# EAGLE design SAMD21_Pro_RF (EAGLE 9.6.2)
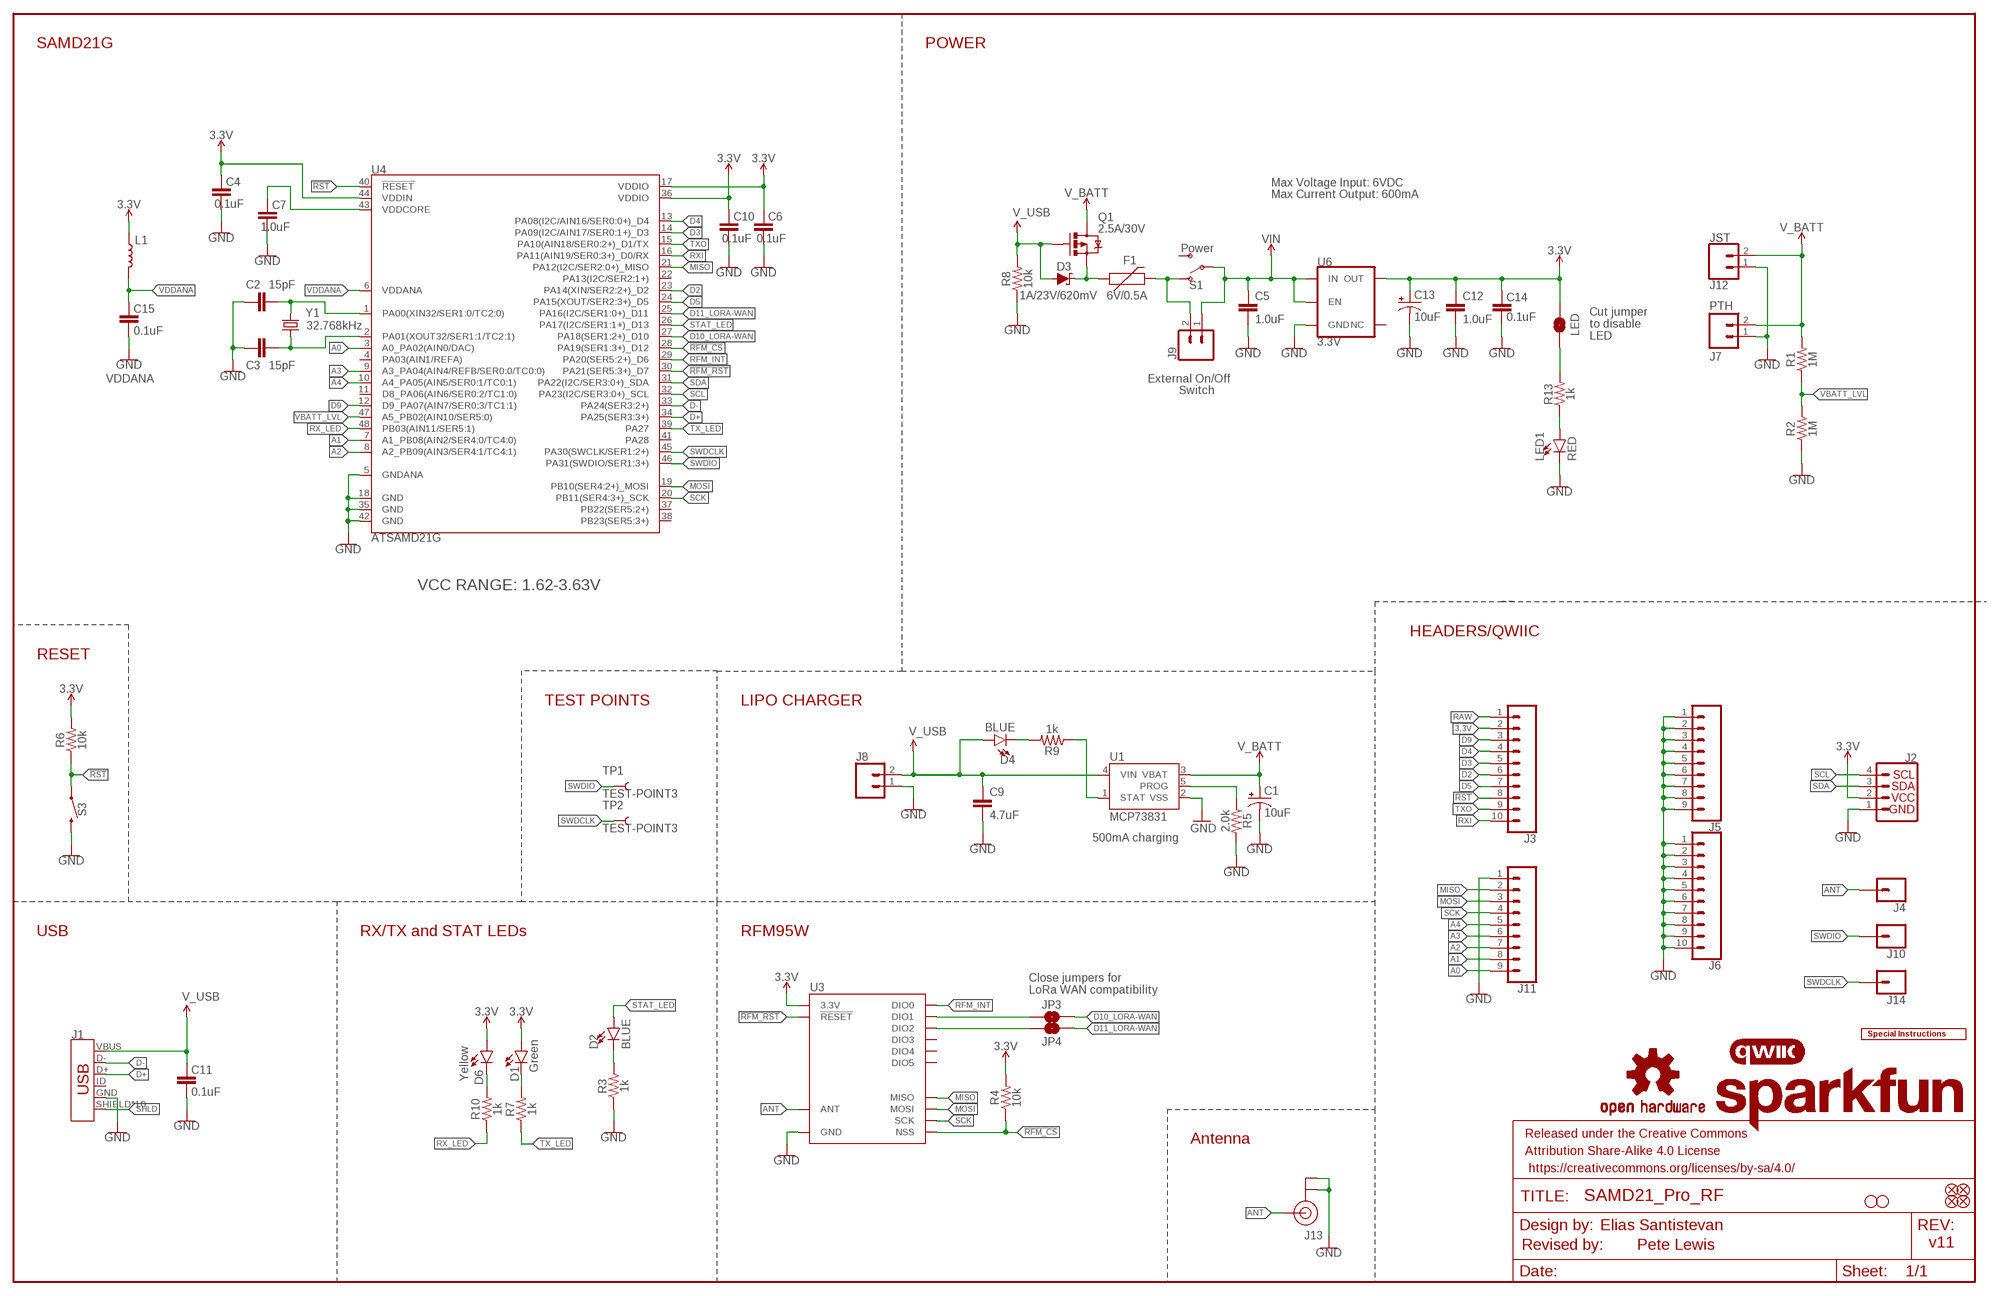
[diagram p0: schematic, sheet 1]

## Parts
C1  10uF  10UF-POLAR-EIA3216-16V-10%(TANT)  [EIA3216]
C2  15pF  15PF-0603-50V-5%  [0603]
C3  15pF  15PF-0603-50V-5%  [0603]
C4  0.1uF  0.1UF-0603-25V-(+80/-20%)  [0603]
C5  1.0uF  1.0UF-0603-16V-10%  [0603]
C6  0.1uF  0.1UF-0603-25V-(+80/-20%)  [0603]
C7  1.0uF  1.0UF-0603-16V-10%  [0603]
C9  4.7uF  4.7UF-0603-6.3V-(10%)  [0603]
C10  0.1uF  0.1UF-0603-25V-(+80/-20%)  [0603]
C11  0.1uF  0.1UF-0603-25V-(+80/-20%)  [0603]
C12  1.0uF  1.0UF-0603-16V-10%  [0603]
C13  10uF  10UF-POLAR-EIA3216-16V-10%(TANT)  [EIA3216]
C14  0.1uF  0.1UF-0603-25V-(+80/-20%)  [0603]
C15  0.1uF  0.1UF-0603-25V-(+80/-20%)  [0603]
D1  Green  LED-GREEN0603  [LED-0603]
D2  BLUE  LED-BLUE0603  [LED-0603]
D3  1A/23V/620mV  DIODE-SCHOTTKY-BAT20J  [SOD-323]
D4  BLUE  LED-BLUE0603  [LED-0603]
D6  Yellow  LED-YELLOW0603  [LED-0603]
F1  6V/0.5A  PPTC_HALF-AMP  [1206]
FD1  FIDUCIAL1X2  [FIDUCIAL-1X2]
FD2  FIDUCIAL1X2  [FIDUCIAL-1X2]
FD3  FIDUCIAL1X2  [FIDUCIAL-1X2]
FD4  FIDUCIAL1X2  [FIDUCIAL-1X2]
FRAME2  FRAME-LEDGER  [CREATIVE_COMMONS]
H1  STAND-OFFTIGHT  [STAND-OFF-TIGHT]
H2  STAND-OFFTIGHT  [STAND-OFF-TIGHT]
J1  USB_MICRO-B_HALF_PTH_MILL  [USB-MICROB-PTH-MILL]
J2  QWIIC_CONNECTORJS-1MM  [1X04_1MM_RA]
J3  CONN_10NO_SILK_PTH_FEMALE  [1X10_NO_SILK]
J4  CONN_01PTH_NO_SILK_YES_STOP  [1X01_NO_SILK]
J5  CONN_09NO_SILK  [1X09_NO_SILK]
J6  CONN_10NO_SILK_PTH_FEMALE  [1X10_NO_SILK]
J7  PTH  CONN_021X02_NO_SILK  [1X02_NO_SILK]
J8  CONN_021X02_NO_SILK  [1X02_NO_SILK]
J9  External On/Off  CONN_021X02_NO_SILK  [1X02_NO_SILK]
J10  CONN_01PTH_NO_SILK_YES_STOP  [1X01_NO_SILK]
J11  CONN_09NO_SILK  [1X09_NO_SILK]
J12  JST  CONN_02-JST-2MM-SMT  [JST-2-SMD]
J13  U.FL  [U.FL]
J14  CONN_01PTH_NO_SILK_YES_STOP  [1X01_NO_SILK]
JP3  JUMPER-SMT_2_NO_SILK  [SMT-JUMPER_2_NO_SILK]
JP4  JUMPER-SMT_2_NO_SILK  [SMT-JUMPER_2_NO_SILK]
L1  INDUCTORFB-30OHM  [0603]
LED  JUMPER-SMT_2_NC_TRACE_SILK  [SMT-JUMPER_2_NC_TRACE_SILK]
LED1  RED  LED-RED0603  [LED-0603]
LOGO1  OSHW-LOGOMINI  [OSHW-LOGO-MINI]
LOGO2  SFE_LOGO_NAME.1_INCH  [SFE_LOGO_NAME_.1]
LOGO3  QWIIC_LOGO_5MM  [QWIIC_5MM]
Q1  2.5A/30V  MOSFET-PCHANNELDMG2307L  [SOT23-3@1]
R1  1M  1MOHM-0603-1/4W-5%  [0603]
R2  1M  1MOHM-0603-1/4W-5%  [0603]
R3  1k  1KOHM-0603-1/10W-1%  [0603]
R4  10k  10KOHM-0603-1/10W-1%  [0603]
R5  2.0k  2.0KOHM-0603-1/10W-5%  [0603]
R6  10k  10KOHM-0603-1/10W-1%  [0603]
R7  1k  1KOHM-0603-1/10W-1%  [0603]
R8  10k  10KOHM-0603-1/10W-1%  [0603]
R9  1k  1KOHM-0603-1/10W-1%  [0603]
R10  1k  1KOHM-0603-1/10W-1%  [0603]
R13  1k  1KOHM-0603-1/10W-1%  [0603]
S1  Power  SWITCH-SPDT-SMD-RIGHT-ANGLE  [SWITCH_SPST_SMD_A]
S3  MOMENTARY-SWITCH-SPST-SMD-RIGHT-ANGLE  [TACTILE_SWITCH_SMD_RIGHT_ANGLE]
TP1  TEST-POINT3  [PAD.03X.03]
TP2  TEST-POINT3  [PAD.03X.03]
U1  MCP73831  [SOT23-5]
U3  RFM95W  [RFM95/96/97/98W]
U4  ATSAMD21G  [QFN-48_NO_EXPOSED_PAD]
U6  3.3V  V_REG_AP2112K-3.3V  [SOT23-5]
U$26  SPECIAL_INSTRUCTIONS-ORDERING  [ORDERING_INSTRUCTIONS]
Y1  32.768kHz  CRYSTAL-32.768KHZSMD-3.2X1.5  [CRYSTAL-SMD-3.2X1.5MM]

## Nets
3.3V [vcc]: C4.2 C6.2 C10.2 C12.1 C13.+ C14.2 D1.A D6.A J2.2 J3.2 L1.1 LED.1 R4.2 R6.2 U3.3.3V U4.17(VDDIO) U4.36(VDDIO) U4.44(VDDIN) U6.5(OUT)
!RFM_CS: R4.1 U3.NSS U4.28(PA19(SER1:3+)_D12)
!RFM_RST: U3.!RESET U4.30(PA21(SER5:3+)_D7)
!RST: J3.8 R6.1 S3.1 U4.40(!RESET!)
A0: J11.9 U4.3(A0_PA02(AIN0/DAC))
A1: J11.8 U4.7(A1_PB08(AIN2/SER4:0/TC4:0))
A2: J11.7 U4.8(A2_PB09(AIN3/SER4:1/TC4:1))
A3: J11.6 U4.9(A3_PA04(AIN4/REFB/SER0:0/TC0:0))
A4: J11.5 U4.10(A4_PA05(AIN5/SER0:1/TC0:1))
ANT: J4.1 J13.FEED(SIGNAL) U3.ANT
CHARGE_STAT: R9.1 U1.1(STAT)
D2: J3.6 U4.23(PA14(XIN/SER2:2+)_D2)
D3: J3.5 U4.14(PA09(I2C/AIN17/SER0:1+)_D3)
D4: J3.4 U4.13(PA08(I2C/AIN16/SER0:0+)_D4)
D5: J3.7 U4.24(PA15(XOUT/SER2:3+)_D5)
D9: J3.3 U4.12(D9_PA07(AIN7/SER0:3/TC1:1))
D10_LORA-WAN: JP3.2 U4.27(PA18(SER1:2+)_D10)
D11_LORA-WAN: JP4.2 U4.25(PA16(I2C/SER1:0+)_D11)
D+: J1.D+ U4.34(PA25(SER3:3+))
D-: J1.D- U4.33(PA24(SER3:2+))
GND: C1.- C2.1 C3.1 C4.1 C5.2 C6.1 C7.1 C9.2 C10.1 C11.1 C12.2 C13.- C14.1 C15.1 J1.GND J2.1 J5.1 J5.2 J5.3 J5.4 J5.5 J5.6 J5.7 J5.8 J5.9 J6.1 J6.2 J6.3 J6.4 J6.5 J6.6 J6.7 J6.8 J6.9 J6.10 J7.1 J8.1 J11.1 J12.1 J13.1(GND) J13.2(GND) LED1.C R2.1 R3.1 R5.2 R8.1 S3.2 U1.2(VSS) U3.GND@1(GND) U3.GND@2(GND) U3.GND@3(GND) U4.5(GNDANA) U4.18(GND) U4.35(GND) U4.42(GND) U6.2(GND)
MISO: J11.2 U3.MISO U4.21(PA12(I2C/SER2:0+)_MISO)
MOSI: J11.3 U3.MOSI U4.19(PB10(SER4:2+)_MOSI)
N$1: D6.C R10.2
N$2: D1.C R7.2
N$3: D2.C R3.2
N$4: C7.2 U4.43(VDDCORE)
N$5: LED.2 R13.2
N$6: C2.2 U4.1(PA00(XIN32/SER1:0/TC2:0)) Y1.P$2
N$7: C3.2 U4.2(PA01(XOUT32/SER1:1/TC2:1)) Y1.P$1
N$8: D4.C R9.2
N$9: F1.2 J9.2 S1.1(O)
N$11: R5.1 U1.5(PROG)
N$17: JP3.1 U3.DIO1
N$18: JP4.1 U3.DIO2
N$38: LED1.A R13.1
RAW [vcc]: D3.C F1.1 J3.1 Q1.2(S)
RFM_INT: U3.DIO0 U4.29(PA20(SER5:2+)_D6)
RX_LED: R10.1 U4.48(PB03(AIN11/SER5:1))
RXI: J3.10 U4.16(PA11(AIN19/SER0:3+)_D0/RX)
SCK: J11.4 U3.SCK U4.20(PB11(SER4:3+)_SCK)
SCL: J2.4 U4.32(PA23(I2C/SER3:0+)_SCL)
SDA: J2.3 U4.31(PA22(I2C/SER3:0+)_SDA)
SHLD: J1.SHIELD J1.SHIELD2(SHIELD) J1.SHIELD3(SHIELD) J1.SHIELD4(SHIELD) J1.SHIELD5(SHIELD) J1.SHIELD6(SHIELD) J1.SHIELD7(SHIELD) J1.SHIELD8(SHIELD) J1.SHIELD9(SHIELD) J1.SHIELD10(SHIELD)
STAT_LED: D2.A U4.26(PA17(I2C/SER1:1+)_D13)
SWDCLK: J14.1 TP2.P$1 U4.45(PA30(SWCLK/SER1:2+))
SWDIO: J10.1 TP1.P$1 U4.46(PA31(SWDIO/SER1:3+))
TX_LED: R7.1 U4.39(PA27)
TXO: J3.9 U4.15(PA10(AIN18/SER0:2+)_D1/TX)
V_BATT: C1.+ J7.2 J12.2 Q1.3(D) R1.2 U1.3(VBAT)
V_USB: C9.1 C11.2 D3.A D4.A J1.VBUS J8.2 Q1.1(G) R8.2 U1.4(VIN)
VBATT_LVL: R1.1 R2.2 U4.47(A5_PB02(AIN10/SER5:0))
VDDANA [vcc]: C15.2 L1.2 U4.6(VDDANA)
VIN: C5.1 J9.1 S1.2(P) U6.1(IN) U6.3(EN)
Unconnected: J1.ID S1.3(S) U3.DIO3 U3.DIO4 U3.DIO5 U4.4(PA03(AIN1/REFA)) U4.11(D8_PA06(AIN6/SER0:2/TC1:0)) U4.22(PA13(I2C/SER2:1+)) U4.37(PB22(SER5:2+)) U4.38(PB23(SER5:3+)) U4.41(PA28) U6.4(NC)

## Notes on the sheet
- SAMD21G | POWER
- Max Voltage Input: 6VDC
- Max Current Output: 600mA
- Cut jumper
  to disable
  LED
- VDDANA
- Switch
- VCC RANGE: 1.62-3.63V
- HEADERS/QWIIC
- RESET
- TEST POINTS | LIPO CHARGER
- 500mA charging
- USB | RX/TX and STAT LEDs | RFM95W
- Close jumpers for
  LoRa WAN compatibility
- Antenna
- Elias Santistevan
- Revised by: | Pete Lewis | v11

## Library data of the parts
C1 C13 = SparkFun-Capacitors:10UF-POLAR: 10.0µF polarized capacitors A capacitor is a passive two-terminal electrical component used to store electrical energy temporarily in an electric field.; PROD_ID: CAP-00811
C2 C3 = SparkFun-Capacitors:15PF: 15pF ceramic capacitors A capacitor is a passive two-terminal electrical component used to store electrical energy temporarily in an electric field.; PROD_ID: CAP-07881
C4 C6 C10 C11 C14 C15 = SparkFun-Capacitors:0.1UF: 0.1µF ceramic capacitors A capacitor is a passive two-terminal electrical component used to store electrical energy temporarily in an electric field.; PROD_ID: CAP-00810
C5 C7 C12 = SparkFun-Capacitors:1.0UF: 1µF ceramic capacitors A capacitor is a passive two-terminal electrical component used to store electrical energy temporarily in an electric field.; PROD_ID: CAP-00868
C9 = SparkFun-Capacitors:4.7UF: 4.7µF ceramic capacitors A capacitor is a passive two-terminal electrical component used to store electrical energy temporarily in an electric field.; PROD_ID: CAP-08280
D1 = SparkFun-LED:LED-GREEN: Green SMD LED Used in manufacturing of various products at SparkFun Packages: 0603 - SMD 0603 package [Product Link] <http://www.futureelectronics.com/en/technologies/semiconductors/optoelectronics/leds/Pages/9894312-LTST-C190GKT.aspx?CrossPart=HSMG-C190&IM=0> LilyPad 1206 - SMD1206 LilyPad package [Product Link] <http://www.futureelectronics.com/en/Technologies/Product.aspx?ProductID=IN150NGHARVATEKCORPORATION2049943&IM=0> 1206 - SMD1206 package [Product Link] <http://www.futureelectronics.com/en/technologies/semiconductors/optoelectronics/leds/Pages/8315665-LTST-C150KGKT.aspx?IM=0> 1206 Bottom Mount -SMD 1206 Bottom Mount [Product Link] <http://www.digikey.com/product-detail/en/lite-on-inc/LTST-C230KGKT/160-1456-1-ND/386854> SparkFun Products: Pro Mini 328 -5V <https://www.sparkfun.com/products/821> RedBoard <https://www.sparkfun.com/products/12757> MP3 Trigger <https://www.sparkfun.com/products/13720> Makey Makey <https://www.sparkfun.com/products/11076>; PROD_ID: DIO-00821; VALUE: GREEN
D2 D4 = SparkFun-LED:LED-BLUE: Blue SMD LED Used in manufacturing of various products at SparkFun Packages: 0603 - SMD 0603 package [Product Link] <http://www.digikey.com/product-detail/en/SMLE12BC7TT86/511-1589-2-ND/1641808> 1206 - SMD1206 package [Product Link] <http://www.digikey.com/product-detail/en/lite-on-inc/LTST-C150TBKT/160-1643-1-ND/573584> SparkFun Products: ESP8266 Thing-Dev Board <https://www.sparkfun.com/products/13711> RedBoard <https://www.sparkfun.com/products/12757>; PROD_ID: DIO-08575
D3 = SparkFun-DiscreteSemi:DIODE-SCHOTTKY: Schottky diode A Schottky diode is a semiconductor diode which has a low forward voltage drop and a very fast switching action.; PROD_ID: DIO-11623
D6 = SparkFun-LED:LED-YELLOW: Yellow SMD LED Used in manufacturing several products at SparkFun. Packages: 0603 - SMD 0603 package[Product Link] <http://www.kingbrightusa.com/product.asp?catalog_name=LED&product_id=APT1608SYCK> 0603 -SMART - SMART SMD 0603 package (more efficient/more expensive) [Product Link] <http://www.osram-os.com/osram_os/en/products/product-catalog/led-light-emitting-diodes/smartled-0603/ly-l29k/index.jsp> LilyPad - SMD1206 package[Product Datasheet] <https://www.sparkfun.com/datasheets/DevTools/LilyPad/Q150YUS4.pdf> SparkFun Products: Blynk Board <https://www.sparkfun.com/products/13794> IOIO-OTG <https://www.sparkfun.com/products/13613> XBee Explorer Serial <https://www.sparkfun.com/products/13225>; PROD_ID: DIO-09003
F1 = SparkFun-Fuses:PPTC: Resettable Fuse PPTC Resettable Fuse. Really a sort of resistor with a polymeric positive temperature coefficient whose resistance increases dramatically with an increase in temperature. When heated by the power passing through the resistance rises causing the current to be limited, protecting the circuit. This is achieved by the transition of the polymer from a crystalline to an amorphous state where the conductive carbon separates breaking the conductive pathways found in the cool crystalline structure. When a PPTC cools back down it resumes conducting letting the circuit turn back on. SparkFun Products: SparkFun RedBoard - Programmed with Arduino <https://www.sparkfun.com/products/12757> Pro Micro - 5V/16MHz <https://www.sparkfun.com/products/12640> Arduino Pro 328 - 5V/16MHz <https://www.sparkfun.com/products/10915> MP3 Trigger <https://www.sparkfun.com/products/13720>; PROD_ID: RES-08585
FD1-FD4 = SparkFun-Aesthetics:FIDUCIAL: Fiducial Alignment Points Point-of-reference for pick-and-place machines and other optical instruments.
FRAME2 = SparkFun-Aesthetics:FRAME-LEDGER: Schematic Frame - Ledger Standard 11x14 US Ledger frame
H1 H2 = SparkFun-Hardware:STAND-OFF: Stand Off Drill holes for mechanically mounting via screws, standoffs, etc. Note: Use the keepout ring to avoid running the screw head into surrounding components. Variant Overviews STAND-OFF - Mechanical footprint for a #4 phillips button head screw. STAND-OFF-TIGHT - Mechanical footprint for a #4 phillips button head screw, Example SparkFun Products Screw - Phillips Head (1/4", 4-40, 10 pack) <https://www.sparkfun.com/products/10453> (PRT-10453) Screw - Phillips Head (1/2", 4-40, 10 pack) <https://www.sparkfun.com/products/10452> (PRT-10452) Screw - Phillips Head (3/4", 4-40, 10 pack) <https://www.sparkfun.com/products/10451> (PRT-10451) Screw - Phillips Head (1", 4-40, 10 pack) <https://www.sparkfun.com/products/10450> (PRT-10450)
J1 = SparkFun-Connectors:USB_MICRO-B: USB Type Micro-B Connector Male/female and PTH/SMT variants SparkFun Products: SparkFun microB USB Breakout <https://www.sparkfun.com/products/12035> SparkFun USB microB Plug Breakout <https://www.sparkfun.com/products/10031> SparkFun ESP8266 Thing <https://www.sparkfun.com/products/13231>; PROD_ID: CONN-13711
J2 = SparkFun-Connectors:QWIIC_CONNECTOR: SparkFun I2C Standard Qwiic Connector An SMD 1mm pitch JST connector makes it easy and quick (get it? Qwiic?) to connect I2C devices to each other. The Qwiic system <http://www.sparkfun.com/qwiic> enables fast and solderless connection between popular platforms and various sensors and actuators. We carry 200mm <https://www.sparkfun.com/products/14204>, 100mm <https://www.sparkfun.com/products/14205>, 50mm <https://www.sparkfun.com/products/14206>, and breadboard friendly <https://www.sparkfun.com/products/14207> Qwiic cables. We also offer 10 pcs strips <https://www.sparkfun.com/products/14323> the SMD connectors.; PROD_ID: CONN-13694
J3 J6 = SparkFun-Connectors:CONN_10: Multi connection point. Often used as Generic Header-pin footprint for 0.1 inch spaced/style header connections On any of the 0.1 inch spaced packages, you can populate with these: Break Away Headers - Straight <https://www.sparkfun.com/products/116> (PRT-00116) Break Away Male Headers - Right Angle <https://www.sparkfun.com/products/553> (PRT-00553) Female Headers <https://www.sparkfun.com/products/115> (PRT-00115) Break Away Headers - Machine Pin <https://www.sparkfun.com/products/117> (PRT-00117) Break Away Female Headers - Swiss Machine Pin <https://www.sparkfun.com/products/743> (PRT-00743) Arduino Stackable Header - 10 Pin <https://www.sparkfun.com/products/11376> (PRT-11376) For SCREWTERMINALS and SPRING TERMINALS visit here: Screw Terimnals on SparkFun.com <https://www.sparkfun.com/search/results?term=Screw+Terminals> (5mm/3.5mm/2.54mm spacing) This device is also useful as a general connection point to wire up your design to another part of your project. Our various solder wires solder well into these plated through hole pads. Hook-Up Wire - Assortment (Stranded, 22 AWG) <https://www.sparkfun.com/products/11375> (PRT-11375) Hook-Up Wire - Assortment (Solid Core, 22 AWG) <https://www.sparkfun.com/products/11367> (PRT-11367) View the entire wire category on our website here <https://www.sparkfun.com/categories/141> Special notes: Molex polarized connector foot print use with SKU : PRT-08231 with associated crimp pins and housings. 1MM SMD Version SKU: PRT-10208 NOTES ON THE VARIANTS LOCK and LOCK_LONGPADS... This footprint was designed to help hold the alignment of a through-hole component (i.e. 6-pin header) while soldering it into place. You may notice that each hole has been shifted either up or down by 0.005 of an inch from it's more standard position (which is a perfectly straight line). This slight alteration caused the pins (the squares in the middle) to touch the edges of the holes. Because they are alternating, it causes a "brace" to hold the component in place. 0.005 has proven to be the perfect amount of "off-center" position when using our standard breakaway headers. Although looks a little odd when you look at the bare footprint, once you have a header in there, the alteration is very hard to notice. Also,if you push a header all the way into place, it is covered up entirely on the bottom side.; PROD_ID: CONN-11563
J4 J10 J14 = SparkFun-Connectors:CONN_01: Single connection point. Often used as Generic Header-pin footprint for 0.1 inch spaced/style header connections On any of the 0.1 inch spaced packages, you can populate with these: Break Away Headers - Straight <https://www.sparkfun.com/products/116> (PRT-00116) Break Away Male Headers - Right Angle <https://www.sparkfun.com/products/553> (PRT-00553) Female Headers <https://www.sparkfun.com/products/115> (PRT-00115) Break Away Headers - Machine Pin <https://www.sparkfun.com/products/117> (PRT-00117) Break Away Female Headers - Swiss Machine Pin <https://www.sparkfun.com/products/743> (PRT-00743) This device is also useful as a general connection point to wire up your design to another part of your project. Our various solder wires solder well into these plated through hole pads. Hook-Up Wire - Assortment (Stranded, 22 AWG) <https://www.sparkfun.com/products/11375> (PRT-11375) Hook-Up Wire - Assortment (Solid Core, 22 AWG) <https://www.sparkfun.com/products/11367> (PRT-11367) View the entire wire category on our website here <https://www.sparkfun.com/categories/141> Special notes: SMTSO-256-ET is a "flush mount" nut for a 4-40 screw. We mostly use this on specialty testbeds; it is a nice way to connect hardware to your PCB at an adjustable hieght. Also note, the SNAP packages are for using a snappable style connector. We sell a baggie of snaps and they are also used on two LilyPad designs: Snap Assortment - 30 pack (male and female) <https://www.sparkfun.com/products/11347> (DEV-11347) LilyPad Arduino SimpleSnap <https://www.sparkfun.com/products/10941> (DEV-10941) LilyPad SimpleSnap Protoboard <https://www.sparkfun.com/products/10940> (DEV-10940)
J5 J11 = SparkFun-Connectors:CONN_09: Multi connection point. Often used as Generic Header-pin footprint for 0.1 inch spaced/style header connections On any of the 0.1 inch spaced packages, you can populate with these: Break Away Headers - Straight <https://www.sparkfun.com/products/116> (PRT-00116) Break Away Male Headers - Right Angle <https://www.sparkfun.com/products/553> (PRT-00553) Female Headers <https://www.sparkfun.com/products/115> (PRT-00115) Break Away Headers - Machine Pin <https://www.sparkfun.com/products/117> (PRT-00117) Break Away Female Headers - Swiss Machine Pin <https://www.sparkfun.com/products/743> (PRT-00743) For SCREWTERMINALS and SPRING TERMINALS visit here: Screw Terimnals on SparkFun.com <https://www.sparkfun.com/search/results?term=Screw+Terminals> (5mm/3.5mm/2.54mm spacing) This device is also useful as a general connection point to wire up your design to another part of your project. Our various solder wires solder well into these plated through hole pads. Hook-Up Wire - Assortment (Stranded, 22 AWG) <https://www.sparkfun.com/products/11375> (PRT-11375) Hook-Up Wire - Assortment (Solid Core, 22 AWG) <https://www.sparkfun.com/products/11367> (PRT-11367) View the entire wire category on our website here <https://www.sparkfun.com/categories/141> Special notes: Molex polarized connector foot print use with SKU : PRT-08231 with associated crimp pins and housings. 1MM SMD Version SKU: PRT-10208 NOTES ON THE VARIANTS LOCK and LOCK_LONGPADS... This footprint was designed to help hold the alignment of a through-hole component (i.e. 6-pin header) while soldering it into place. You may notice that each hole has been shifted either up or down by 0.005 of an inch from it's more standard position (which is a perfectly straight line). This slight alteration caused the pins (the squares in the middle) to touch the edges of the holes. Because they are alternating, it causes a "brace" to hold the component in place. 0.005 has proven to be the perfect amount of "off-center" position when using our standard breakaway headers. Although looks a little odd when you look at the bare footprint, once you have a header in there, the alteration is very hard to notice. Also,if you push a header all the way into place, it is covered up entirely on the bottom side.
J7-J9 = SparkFun-Connectors:CONN_02: Multi connection point. Often used as Generic Header-pin footprint for 0.1 inch spaced/style header connections On any of the 0.1 inch spaced packages, you can populate with these: Break Away Headers - Straight <https://www.sparkfun.com/products/116> (PRT-00116) Break Away Male Headers - Right Angle <https://www.sparkfun.com/products/553> (PRT-00553) Female Headers <https://www.sparkfun.com/products/115> (PRT-00115) Break Away Headers - Machine Pin <https://www.sparkfun.com/products/117> (PRT-00117) Break Away Female Headers - Swiss Machine Pin <https://www.sparkfun.com/products/743> (PRT-00743) For SCREWTERMINALS and SPRING TERMINALS visit here: Screw Terimnals on SparkFun.com <https://www.sparkfun.com/search/results?term=Screw+Terminals> (5mm/3.5mm/2.54mm spacing) This device is also useful as a general connection point to wire up your design to another part of your project. Our various solder wires solder well into these plated through hole pads. Hook-Up Wire - Assortment (Stranded, 22 AWG) <https://www.sparkfun.com/products/11375> (PRT-11375) Hook-Up Wire - Assortment (Solid Core, 22 AWG) <https://www.sparkfun.com/products/11367> (PRT-11367) View the entire wire category on our website here <https://www.sparkfun.com/categories/141> Special notes: Molex polarized connector foot print use with: PRT-08233 with associated crimp pins and housings. 2.54_SCREWTERM for use with PRT-10571. 3.5mm Screw Terminal footprints for PRT-08084 5mm Screw Terminal footprints for use with PRT-08432
J12 = SparkFun-Connectors:CONN_02: Multi connection point. Often used as Generic Header-pin footprint for 0.1 inch spaced/style header connections On any of the 0.1 inch spaced packages, you can populate with these: Break Away Headers - Straight <https://www.sparkfun.com/products/116> (PRT-00116) Break Away Male Headers - Right Angle <https://www.sparkfun.com/products/553> (PRT-00553) Female Headers <https://www.sparkfun.com/products/115> (PRT-00115) Break Away Headers - Machine Pin <https://www.sparkfun.com/products/117> (PRT-00117) Break Away Female Headers - Swiss Machine Pin <https://www.sparkfun.com/products/743> (PRT-00743) For SCREWTERMINALS and SPRING TERMINALS visit here: Screw Terimnals on SparkFun.com <https://www.sparkfun.com/search/results?term=Screw+Terminals> (5mm/3.5mm/2.54mm spacing) This device is also useful as a general connection point to wire up your design to another part of your project. Our various solder wires solder well into these plated through hole pads. Hook-Up Wire - Assortment (Stranded, 22 AWG) <https://www.sparkfun.com/products/11375> (PRT-11375) Hook-Up Wire - Assortment (Solid Core, 22 AWG) <https://www.sparkfun.com/products/11367> (PRT-11367) View the entire wire category on our website here <https://www.sparkfun.com/categories/141> Special notes: Molex polarized connector foot print use with: PRT-08233 with associated crimp pins and housings. 2.54_SCREWTERM for use with PRT-10571. 3.5mm Screw Terminal footprints for PRT-08084 5mm Screw Terminal footprints for use with PRT-08432; PROD_ID: CONN-11443
J13 = SparkFun-Connectors:U.FL: SMD Antenna Connector - U.FL 2mm height, 3.0mm x 3.0mm receptacle size. SparkFun Products: SparkFun WiFi Shield - ESP8266 <https://www.sparkfun.com/products/13287> SparkFun ESP8266 Thing <https://www.sparkfun.com/products/13231> SparkFun MiniGen - Pro Mini Signal Generator Shield <https://www.sparkfun.com/products/11420>; PROD_ID: CONN-09193; SF_ID: WRL-09144
JP3 JP4 = SparkFun-Jumpers:JUMPER-SMT_2_NO: Normally open jumper This jumper has two pads in close proximity to each other. Apply solder to close the connection. Round pads are easier to solder for beginners, but are a lot larger. SparkFun Product that uses the round pads: SparkFun EL Sequencer <https://www.sparkfun.com/products/12781>
L1 = SparkFun-Coils:INDUCTOR: Inductors Resist changes in electrical current. Basically a coil of wire. SparkFun Products: SparkFun Load Cell Amplifier - HX711 <https://www.sparkfun.com/products/13879> IOIO-OTG - V2.2 <https://www.sparkfun.com/products/13613>; PROD_ID: NDUC-07859
LED = SparkFun-Jumpers:JUMPER-SMT_2_NC_TRACE: Normally closed trace jumper This jumper has a trace between two pads so it's normally closed (NC). Use a razor knife to open the connection. For best results follow the IPC guidelines for cutting traces: Cutout at least 0.063 mm (0.005 in). Remove all loose material to clean up the cut area. Seal the cut with an approved epoxy. Reapply solder to reclose the connection.
LED1 = SparkFun-LED:LED-RED: Red SMD LED Used in manufacturing of most products at SparkFun Packages: 0603 - SMD 0603 package [Product Link] <http://docs.avagotech.com/docs/AV02-0551EN> 0603 SMART - SMD 0603 SMART package ( more efficient and expensive)[Product Link] <http://www.osram-os.com/Graphics/XPic2/00077099_0.pdf> 1206 - SMD1206 package [Product Link] <https://www.sparkfun.com/datasheets/DevTools/LilyPad/Q150OVS4.pdff> SparkFun Products: Pro Mini 328 -5V <https://www.sparkfun.com/products/821> RedBoard <https://www.sparkfun.com/products/12757> IOIO-OTG <https://www.sparkfun.com/products/13613>; PROD_ID: DIO-00819
LOGO1 = SparkFun-Aesthetics:OSHW-LOGO: Open-Source Hardware (OSHW) Logo This logo indicates the piece of hardware it is found on incorporates a OSHW license and/or adheres to the definition of open source hardware found here: http://freedomdefined.org/OSHW
LOGO2 = SparkFun-Aesthetics:SFE_LOGO_NAME: SparkFun Font Logo This is the SparkFun name logo. The logo on the schematic will always be the same size; the package variant is the height of the flame part of the logo (or the height the flame would be, if it were drawn). Default layer for the logo on the board is tSilk.
LOGO3 = SparkFun-Aesthetics:QWIIC_LOGO: Qwiic Logos for placement on schematic and PCB. The 5.5mm silk logo is best for placing next to Qwiic connector.
Q1 = SparkFun-DiscreteSemi:MOSFET-PCHANNEL: Generic PMOSFET IRLML2244 - TRANS-11153 (SOT-23 -20V -4.3A) (1.Gate 2.Source 3.Drain) FQP27P06 - COM-10349 <http://www.sparkfun.com/products/10349> (TO-220 -60V -27A) (1.Gate 2.Source 3.Drain); PROD_ID: TRANS-11308
R1 R2 = SparkFun-Resistors:1MOHM: 1MΩ resistor A resistor is a passive two-terminal electrical component that implements electrical resistance as a circuit element. Resistors act to reduce current flow, and, at the same time, act to lower voltage levels within circuits. - Wikipedia; PROD_ID: RES-07868
R3 R7 R9 R10 R13 = SparkFun-Resistors:1KOHM: 1kΩ resistor A resistor is a passive two-terminal electrical component that implements electrical resistance as a circuit element. Resistors act to reduce current flow, and, at the same time, act to lower voltage levels within circuits. - Wikipedia; PROD_ID: RES-07856
R4 R6 R8 = SparkFun-Resistors:10KOHM: 10kΩ resistor A resistor is a passive two-terminal electrical component that implements electrical resistance as a circuit element. Resistors act to reduce current flow, and, at the same time, act to lower voltage levels within circuits. - Wikipedia; PROD_ID: RES-00824
R5 = SparkFun-Resistors:2.0KOHM: 2kΩ resistor A resistor is a passive two-terminal electrical component that implements electrical resistance as a circuit element. Resistors act to reduce current flow, and, at the same time, act to lower voltage levels within circuits. - Wikipedia; PROD_ID: RES-08296
S1 = SparkFun-Switches:SWITCH-SPDT: Single Pole, Double Throw (SPDT) Switch Single-pole, double-throw (SPDT) switch. Variant Overview SMD-AYZ0202 Surface Mount DPDT Switch <https://www.sparkfun.com/products/597> (COM-00597) Used on e.g. LilyPad Arduino USB - ATmega32U4 Board <https://www.sparkfun.com/products/12049> PTH-11.6X4.0MM SPDT Mini Power Switch <https://www.sparkfun.com/products/102> (COM-00102) Used on e.g. SparkFun Simon Says - Through-Hole Soldering Kit <https://www.sparkfun.com/products/10547> (KIT-10547) PTH-11.6X4.0MM-KIT KIT version of SPDT Mini Power Switch - Simplifies soldering by removing tStop of switch pins - only one side can be soldered. PTH-11.6X4.0MM-LOCK LOCK version of SPDT Mini Power Switch - Offset pins hold switch in place for easier soldering. SMD-RIGHT-ANGLE Surface Mount Right Angle Switch <https://www.sparkfun.com/products/10860> (COM-10860) Used on e.g. SparkFun ESP8266 Thing <https://www.sparkfun.com/products/13231>; PROD_ID: SWCH-10651; SF_SKU: COM-10860
S3 = SparkFun-Switches:MOMENTARY-SWITCH-SPST: Momentary Switch (Pushbutton) - SPST Normally-open (NO) SPST momentary switches (buttons, pushbuttons). Variants PTH-12MM - 12mm square, through-hole Momentary Pushbutton Switch - 12mm Square <https://www.sparkfun.com/products/9190> (COM-09190) PTH-6.0MM, PTH-6.0MM-KIT - 6.0mm square, through-hole Mini Pushbutton Switch <https://www.sparkfun.com/products/97> (COM-00097) KIT package intended for soldering kit's - only one side of pads' copper is exposed. PTH-RIGHT-ANGLE-KIT - Right-angle, through-hole Right Angle Tactile Button <https://www.sparkfun.com/products/10791> - Used on SparkFun BigTime Watch Kit <https://www.sparkfun.com/products/11734> SMD-12MM - 12mm square, surface-mount Tactile Button - SMD (12mm) <https://www.sparkfun.com/products/12993> (COM-12993) Used on SparkFun PicoBoard <https://www.sparkfun.com/products/11888> SMD-4.5MM - 4.5mm Square Trackball Switch Used on SparkFun Blackberry Trackballer Breakout <https://www.sparkfun.com/products/13169> SMD-4.6MMX2.8MM - 4.60mm x 2.80mm, surface mount Used on SparkFun SAMD21 Mini Breakout <https://www.sparkfun.com/products/13664> SMD-5.2MM, SMD-5.2-REDUNDANT - 5.2mm square, surface-mount Mini Pushbutton Switch - SMD <https://www.sparkfun.com/products/8720> (COM-08720) Used on Arduino Pro Mini <https://www.sparkfun.com/products/11114> REDUNDANT package connects both switch circuits together SMD-6.0X3.5MM - 6.0 x 3.5mm, surface mount Momentary Reset Switch SMD <https://www.sparkfun.com/products/8229> (COM-08229) SMD-6.2MM-TALL - 6.2mm square, surface mount Tactile Button - SMD (6mm) <https://www.sparkfun.com/products/12992> Used on SparkFun Digital Sandbox <https://www.sparkfun.com/products/12651> SMD-RIGHT-ANGLE - Right-angle, surface mount Used on SparkFun Block for Intel® Edison - Arduino <https://www.sparkfun.com/products/13036>; PROD_ID: COMP-12265
TP1 TP2 = SparkFun-Connectors:TEST-POINT: SparkFun Test Points Bare copper test points for troubleshooting or In-Circuit-Testing. These are used by our Production team for verifying production board runs using pogo-pins on test beds. SparkFun Products: SparkFun LSM9DS1 Breakout <https://www.sparkfun.com/products/13284> SparkFun PSOC <https://www.sparkfun.com/products/13714> SparkFun Load Cell Amplifier <https://www.sparkfun.com/products/13879>
U1 = SparkFun-IC-Power:MCP73831: MCP73831T Li-Ion, Li-Pol Controller Miniature single cell, fully integrated Li-Ion, Li-polymer charge management controller Datasheet <http://ww1.microchip.com/downloads/en/DeviceDoc/20001984g.pdf> SparkFun Products: SparkFun ESP32 Thing <https://www.sparkfun.com/products/13907> SparkFun 9DoF Razor IMU M0 <https://www.sparkfun.com/products/14001>; PROD_ID: IC-09995
U3 = SparkFun-RF:RFM95W: RFM95/96/97/98 The RFM95/96/97/98(W) transceivers feature the LoRaTM long range modem that provides ultra-long range spread spectrum communication and high interference immunity whilst minimising current consumption. These devices also support high performance (G)FSK modes for systems including WMBus, IEEE802.15.4g. The RFM95/96/97/98(W) deliver exceptional phase noise, selectivity, receiver linearity and IIP3 for significantly lower current consumption than competing devices Datasheet <http://www.hoperf.com/upload/rf/RFM95_96_97_98W.pdf>; PROD_ID: IC-13959
U4 = SparkFun-IC-Microcontroller:ATSAMD21G: Atmel SAMD21G SMART ARM-Based Microcontroller The Atmel ® | SMART ™ SAM D21 is a series of low-power microcontrollers using the 32-bit ARM ® Cortex ® -M0+ processor, and ranging from 32- to 64-pins with up to 256KB Flash and 32KB of SRAM. The SAM D21 devices operate at a maximum frequency of 48MHz and reach 2.46 CoreMark/MHz. They are designed for simple and intuitive migration with identical peripheral modules, hex compatible code, identical linear address map and pin compatible migration paths between all devices in the product series. All devices include intelligent and flexible peripherals, Atmel Event System for inter-peripheral signaling, and support for capacitive touch button, slider and wheel user interfaces. Datasheet <https://cdn.sparkfun.com/datasheets/Dev/Arduino/Boards/Atmel-42181-SAM-D21_Datasheet.pdf> SparkFun Products SparkFun SAMD21 Mini Breakout <https://www.sparkfun.com/products/13664> (DEV-13664) SparkFun SAMD21 Dev Breakout <https://www.sparkfun.com/products/13672> (DEV-13672) (DEV-14926); PROD_ID: IC-14066
U6 = SparkFun-IC-Power:V_REG_AP2112: AP2112 - 600mA CMOS LDO Regulator w/ Enable The AP2112 is CMOS process low dropout linear regulator with enable function, the regulator delivers a guaranteed 600mA (min.) continuous load current. Features Output Voltage Accuracy: ±1.5% Output Current: 600mA (Min.) Foldback Short Current Protection: 50mA Enable Function to Turn ON/OFF VOUT Low Dropout Voltage (3.3V): 250mV (Typ.) @IOUT=600mA Excellent Load Regulation: 0.2%/A (Typ.) Excellent Line Regulation: 0.02%/V (Typ.) Low Quiescent Current: 55μA (Typ.) Low Standby Current: 0.01μA (Typ.) Low Output Noise: 50μVRMS PSRR: 100Hz -65dB, 1kHz -65dB OTSD Protection Stable with 1.0μF Flexible Cap: Ceramic, Tantalum and Aluminum Electrolytic Operation Temperature Range: -40°C to 85°C ESD: MM 400V, HBM 4000V; PROD_ID: VREG-12457
U$26 = SparkFun-Aesthetics:SPECIAL_INSTRUCTIONS: Special Ordering/Production Instructions Alert Symbol for special PCB ordering instructions or unique production process warnings. Ordering Instructions Production Instructions Types of information that should be added to box: Copper weight Soldermask color Silk color PCB thickness Number of layers PCB Standard: 1.6mm FR4 1 oz copper immersion silver plating red soldermask white silkscreen Types of information that should be added to box: Special wash requirements Depaneling instructions Humidification Glue curing Default text settings: 0.07 inch 9% ratio 50% line distance
Y1 = SparkFun-Clocks:CRYSTAL-32.768KHZ: 32.768kHz Crystal Frequency: 32.768kHz Frequency Stability: ±20ppm Load Capacitance: 12.5pF (PTH-2X6 & SMD-3.2X1.5), 6pF (SMD-2X6) SparkFun Products: SparkFun BigTime Watch Kit <https://www.sparkfun.com/products/11734> SparkFun nRF52832 Breakout <https://www.sparkfun.com/products/13990> SparkFun Real Time Clock Module <https://www.sparkfun.com/products/12708>; PROD_ID: XTAL-13062

## Net classes
0 default: width 0 mm, drill 0 mm
1 vcc: width 0 mm

## Board
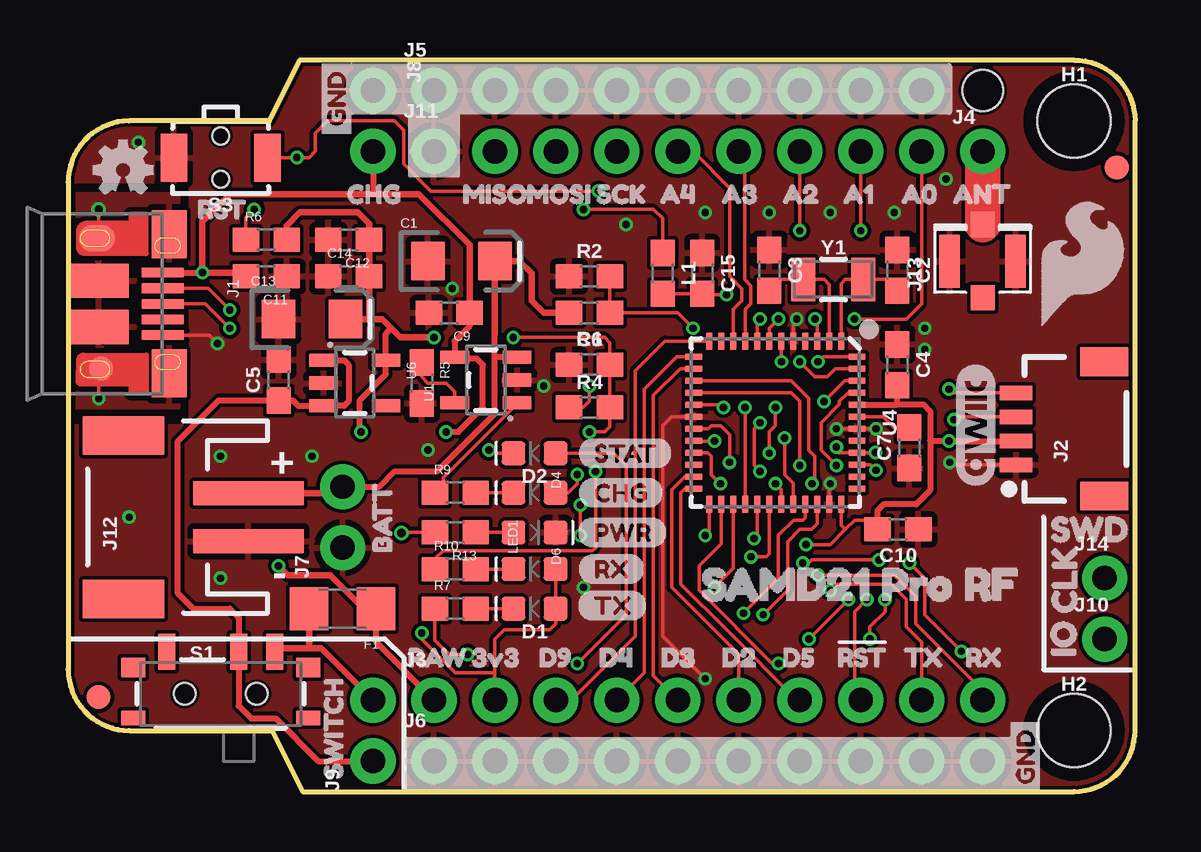
[diagram p1: board, top side]
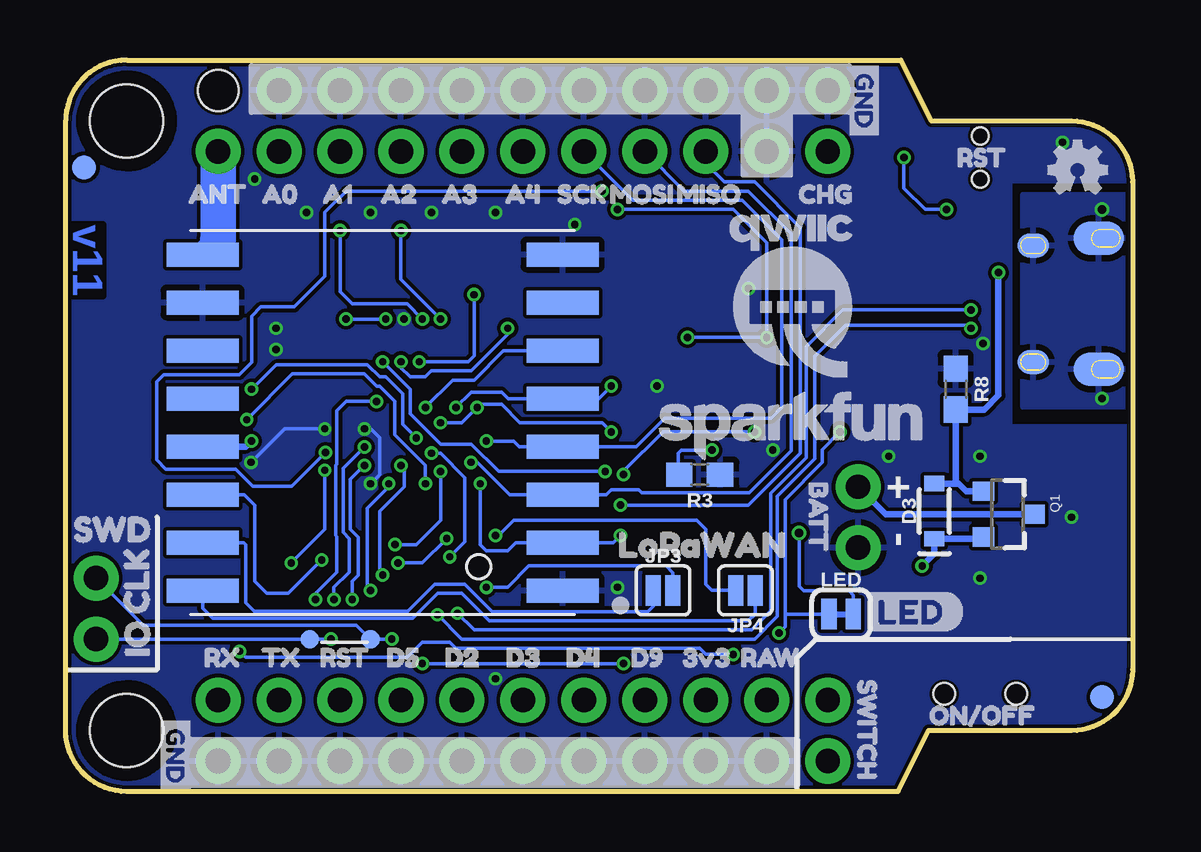
[diagram p2: board, bottom side, seen from below]

Size 44.45 x 30.48 mm. Coordinates in mm from the lower left corner, seen from the top.
Outline: 8.51,2.54 9.78,0 41.91,0 arc90 44.45,2.54 44.45,27.94 arc90 41.91,30.48 9.65,30.48 8.38,27.94 2.54,27.94 arc90 0,25.4 0,5.08 arc90 2.54,2.54 8.51,2.54
Copper layers (1*16): Top 0.035mm / dielectric 1.5mm / Bottom 0.035mm
Design rules "SparkFun-2-layer-FAB-LIMIT": minimum track width 4mil, minimum drill 6mil, track to track 4mil, track to pad 4mil, pad to pad 4mil, via to via 4mil, smd to smd 4mil, copper to edge 4mil, drill to drill 4mil, minimum pad ring 5mil, minimum via ring 5mil, stop-mask expansion 4mil, vias tented up to drill 25mil, thermal gap 10mil
Holes 1.7 mm at 38.1,29.21

### Footprints (pad centres in the part's own frame; a part is rotated, then mirrored left to right if it is on the bottom)
EIA3216 = smd 1.4 x 1.6: + 1.4,0; - -1.4,0
0603 = smd 1.1 x 1: 1 -0.85,0; 2 0.85,0
LED-0603 = smd 1 x 1: A -0.877,0; C 0.877,0
SOD-323 = smd 0.63 x 0.83: A 1.15,0; C -1.15,0
1206 = smd 1.6 x 1.8: 1 -1.4,0; 2 1.4,0
FIDUCIAL-1X2 = smd 1 x 1: 1 0,0
STAND-OFF-TIGHT = hole 3.048: 0,0
USB-MICROB-PTH-MILL = smd 0.4 x 1.75: D+ 0,0; D- -0.65,0; GND 1.3,0; ID 0.65,0; VBUS -1.3,0 | smd 2 x 1.46: SHIELD -2.9,0.275; SHIELD2 2.9,0.275 | smd 1.425 x 2.5: SHIELD3 -0.963,-2.675; SHIELD4 0.963,-2.675 | smd 1.4 x 2.1 bottom: SHIELD5 -2.731,-2.531; SHIELD7 2.729,-2.531 | smd 1 x 1: SHIELD6 2.7,-2.575 | smd 1.1 x 1.5: SHIELD8 -2.731,-2.731 | smd 1 x 1.3 bottom: SHIELD9 -2.43,0.195; SHIELD10 2.43,0.195
1X04_1MM_RA = smd 0.6 x 1.35: 1 -1.5,0; 2 -0.5,0; 3 0.5,0; 4 1.5,0 | smd 1.2 x 2: NC1 2.8,-3.675; NC2 -2.8,-3.675
1X10_NO_SILK = drill 1.016 pad 1.88: 1 0,0; 2 2.54,0; 3 5.08,0; 4 7.62,0; 5 10.16,0; 6 12.7,0; 7 15.24,0; 8 17.78,0; 9 20.32,0; 10 22.86,0
1X01_NO_SILK = drill 1.016 pad 1.88: 1 0,0
1X09_NO_SILK = drill 1.016 pad 1.88: 1 0,0; 2 2.54,0; 3 5.08,0; 4 7.62,0; 5 10.16,0; 6 12.7,0; 7 15.24,0; 8 17.78,0; 9 20.32,0
1X02_NO_SILK = drill 1.016 pad 1.88: 1 0,0; 2 2.54,0
JST-2-SMD = smd 1 x 4.6: 1 -1,-3.7; 2 1,-3.7 | smd 1.6 x 3.4: NC1 -3.4,1.5; NC2 3.4,1.5
U.FL = smd 2.2 x 0.85: 1 0,1.375; 2 0,-1.375 | smd 1.05 x 1: FEED 1.525,0; NC -1.525,0
SMT-JUMPER_2_NO_SILK = smd 0.635 x 1.27: 1 -0.406,0; 2 0.406,0
SMT-JUMPER_2_NC_TRACE_SILK = smd 0.635 x 1.27: 1 -0.508,0; 2 0.508,0
SOT23-3@1 = smd 0.8 x 0.9: 1 -0.95,-1; 2 0.95,-1; 3 0,1.1
SWITCH_SPST_SMD_A = smd 0.7 x 1.5: 1 -2.25,-1.75; 2 -0.75,-1.75; 3 2.25,-1.75 | smd 1 x 0.6: GND1 -3.65,1; GND3 3.65,1 | smd 1 x 0.8: GND2 -3.65,-1.1; GND4 3.65,-1.1 | hole 0.9: -1.5,0; 1.5,0
TACTILE_SWITCH_SMD_RIGHT_ANGLE = smd 1.1 x 2: 1 -1.95,0; 2 1.95,0 | hole 0.7: 0,0.9; 0,-0.9
PAD.03X.03 = smd 0.762 x 0.762: P$1 0,0
SOT23-5 = smd 0.55 x 1.2: 1 -0.95,-1.3; 2 0,-1.3; 3 0.95,-1.3; 4 0.95,1.3; 5 -0.95,1.3
RFM95/96/97/98W = smd 3 x 1: 3.3V 7.5,1; !RESET -7.5,-3; ANT 7.5,-7; DIO0 7.5,3; DIO1 7.5,5; DIO2 7.5,7; DIO3 7.5,-3; DIO4 7.5,-1; DIO5 -7.5,-5; GND@1 -7.5,7; GND@2 -7.5,-7; GND@3 7.5,-5; MISO -7.5,5; MOSI -7.5,3; NSS -7.5,-1; SCK -7.5,1
QFN-48_NO_EXPOSED_PAD = smd 0.7 x 0.25: 1 -3.4,2.75; 2 -3.4,2.25; 3 -3.4,1.75; 4 -3.4,1.25; 5 -3.4,0.75; 6 -3.4,0.25; 7 -3.4,-0.25; 8 -3.4,-0.75; 9 -3.4,-1.25; 10 -3.4,-1.75; 11 -3.4,-2.25; 12 -3.4,-2.75; 25 3.4,-2.75; 26 3.4,-2.25; 27 3.4,-1.75; 28 3.4,-1.25; 29 3.4,-0.75; 30 3.4,-0.25; 31 3.4,0.25; 32 3.4,0.75; 33 3.4,1.25; 34 3.4,1.75; 35 3.4,2.25; 36 3.4,2.75 | smd 0.25 x 0.7: 13 -2.75,-3.4; 14 -2.25,-3.4; 15 -1.75,-3.4; 16 -1.25,-3.4; 17 -0.75,-3.4; 18 -0.25,-3.4; 19 0.25,-3.4; 20 0.75,-3.4; 21 1.25,-3.4; 22 1.75,-3.4; 23 2.25,-3.4; 24 2.75,-3.4; 37 2.75,3.4; 38 2.25,3.4; 39 1.75,3.4; 40 1.25,3.4; 41 0.75,3.4; 42 0.25,3.4; 43 -0.25,3.4; 44 -0.75,3.4; 45 -1.25,3.4; 46 -1.75,3.4; 47 -2.25,3.4; 48 -2.75,3.4
CRYSTAL-SMD-3.2X1.5MM = smd 1 x 1.8: P$1 -1.25,0; P$2 1.25,0

### Placement (x,y rotation side)
C1  16.38,22.1 0 top
C2  34.54,21.72 270 top
C3  29.21,21.72 270 top
C4  34.54,17.78 270 top
C5  8.76,17.14 90 top
C6  21.72,17.78 0 top
C7  35.05,14.33 90 top
C9  15.88,19.94 180 top
C10  34.57,10.92 180 top
C11  8.26,21.46 180 top
C12  11.68,22.99 180 top
C13  10.16,19.68 0 top
C14  11.68,21.46 0 top
C15  26.42,21.59 270 top
D1  19.43,7.62 180 top
D2  19.43,14.1 180 top
D3  8.26,11.68 90 bottom
D4  19.43,12.45 180 top
D6  19.43,9.27 180 top
F1  11.43,7.62 180 top
FD1  1.27,3.94 0 bottom
FD2  43.69,26.01 0 bottom
FD3  1.27,3.94 0 top
FD4  43.69,26.01 0 top
FRAME2  -13.97,-12.7 0 top  (outside the outline)
H1  41.91,27.94 0 top
H2  41.91,2.54 0 top
J1  3.94,20.32 270 top
J2  39.5,15.11 90 top
J3  15.24,3.81 0 top
J4  38.1,26.67 0 top
J5  15.24,29.21 0 top
J6  15.24,1.27 0 top
J7  11.43,10.16 90 top
J8  12.7,29.21 270 top
J9  12.7,1.27 90 top
J10  43.18,6.35 0 top
J11  15.24,26.67 0 top
J12  3.81,11.43 90 top
J13  38.1,22.1 90 top
J14  43.18,8.89 0 top
JP3  19.56,8.38 0 bottom
JP4  16.13,8.38 180 bottom
L1  24.77,21.59 270 top
LED  12.14,7.39 0 bottom
LED1  19.43,10.79 0 top
LOGO1  2.29,25.91 0 bottom
LOGO2  20.19,13.34 0 bottom
LOGO3  37.8,15.24 90 top
Q1  5.21,11.56 270 bottom
R1  21.72,19.94 180 top
R2  21.72,21.46 0 top
R3  18.03,13.21 180 bottom
R4  21.72,16 0 top
R5  14.73,17.02 270 top
R6  8.26,22.99 0 top
R7  16.13,7.62 0 top
R8  7.37,16.76 270 bottom
R9  16.13,12.45 0 top
R10  16.13,9.27 0 top
R13  16.13,10.79 180 top
S1  6.35,4.06 180 top
S3  6.35,26.42 180 top
TP1  34.29,6.35 90 bottom
TP2  31.75,6.35 90 bottom
U1  17.4,17.14 90 top
U3  31.24,15.37 180 bottom
U4  29.46,15.37 270 top
U6  11.94,17.02 270 top
U$1  [SAMD21_PRO_RF0]  25.27,8.64 0 top
U$2  [D20]  29.34,5.59 0 bottom
U$3  [A43]  24,24.89 0 top
U$4  [A34]  26.54,24.89 0 top
U$5  [A25]  29.08,24.89 0 top
U$6  [A16]  31.62,24.89 0 top
U$7  [A07]  34.04,24.89 0 top
U$8  [MISO8]  15.75,24.89 0 top
U$9  [MOSI9]  18.41,24.89 0 top
U$10  [SCK10]  21.34,24.89 0 top
U$11  [ANT11]  36.2,24.89 0 top
U$12  [GND0]  11.18,27.05 90 top
U$13  [RST2]  31.37,5.59 0 top
U$14  [CHG1]  10.92,24.89 0 top
U$15  [D90]  18.92,5.59 0 top
U$16  [D90]  21.59,5.59 0 bottom
U$17  [GND0]  39.88,3.3 270 bottom
U$18  [D20]  26.54,5.59 0 top
U$19  [RX2]  39.37,5.59 0 bottom
U$20  [D30]  24,5.59 0 top
U$21  [D30]  26.8,5.59 0 bottom
U$22  [D40]  21.46,5.59 0 top
U$23  [3V320]  16.13,5.59 0 top
U$24  [RAW21]  13.46,5.59 0 top
U$25  [LORA0]  22.35,10.29 0 bottom
U$26  52.07,49.53 0 top  (outside the outline)
U$27  [SWITCH23]  11.05,-0.13 90 top
U$28  [RST2]  4.7,24.26 0 top
U$29  [BATT25]  13.08,9.27 90 top
U$30  [QWIIC-LOGO-MEDIUM]  14.22,20.7 0 bottom
U$31  [D40]  24.26,5.59 0 bottom
U$32  [BATT25]  13.08,13.59 270 bottom
U$33  [D50]  31.75,5.59 0 bottom
U$34  [IO3]  41.45,4.7 90 top
U$35  [WAN1]  18.92,10.29 0 bottom
U$36  [RST2]  8,26.42 0 bottom
U$37  [SWITCH23]  11.05,5.33 270 bottom
U$38  [GND0]  11.18,30.61 270 bottom
U$39  [ON#OFF0]  9.14,3.17 0 bottom
U$40  [CHG1]  14.61,24.89 0 bottom
U$41  [RST2]  34.54,5.59 0 bottom
U$42  [A43]  26.8,24.89 0 bottom
U$43  [A34]  29.46,24.89 0 bottom
U$44  [A25]  32,24.89 0 bottom
U$45  [A16]  34.42,24.89 0 bottom
U$46  [A07]  36.96,24.89 0 bottom
U$47  [MISO8]  19.68,24.89 0 bottom
U$48  [MOSI9]  22.48,24.89 0 bottom
U$49  [SCK10]  24.64,24.89 0 bottom
U$50  [ANT11]  40.01,24.89 0 bottom
U$51  [SFE_LOGO_FLAME_.2]  40.23,19.18 0 top
U$52  [RAW21]  17.02,5.59 0 bottom
U$53  [3V320]  19.43,5.59 0 bottom
U$54  [STAT0]  21.21,14.1 0 top
U$55  [D514]  29.08,5.59 0 top
U$56  [CLK4]  41.5,6.53 90 top
U$57  [TX3]  36.96,5.59 0 bottom
U$58  [SWD2]  40.01,10.92 0 top
U$59  [SWD2]  45.06,10.92 0 bottom
U$60  [CLK4]  41.5,6.5 90 bottom
U$61  [OSHW-LOGO-MINI]  2.29,25.91 0 top
U$62  [GND0]  39.88,-0.38 90 top
U$63  [PWR-()-03]  21.21,10.79 0 top
U$64  [IO3]  41.48,4.7 90 bottom
U$65  [CHG1]  21.21,12.45 0 top
U$66  [LED0]  11.56,7.49 0 bottom
U$69  [TX3]  34.16,5.59 0 top
U$70  [TX6]  21.21,7.75 0 top
U$72  [RX7]  21.21,9.27 0 top
U$73  [RX2]  36.7,5.59 0 top
Y1  31.88,21.34 0 top

### Tracks (layer width: path | path; a pad name or v marks a point on that pad's centre or on a via)
3.3V  (via drill 0.3)
  Top 0.152: U4.17 27.19,16.12 v27.3,16 | v21.72,14.99 22.35,14.99 22.57,15.2 R4.2 C6.2 22.57,18.71 22.35,18.92 v18.54,18.92 | v28.83,13.34 28.57,13.59 28.57,15.11 v28.83,15.37 | 32.38,10.92 31.75,10.29 v30.73,10.29 | U4.36 32.21,11.09 32.38,10.92 | 17.78,4.95 17.78,6.35 18.16,6.73 20.07,6.73 20.32,6.99 20.31,7 D1.A D6.A | L1.1 24.77,23.88 24.38,24.26 v21.46,24.26 | 17.78,4.95 16.13,4.95 14.73,6.35 v14.73,6.6 | 32.38,10.92 32.77,11.3 33.34,11.3 C10.2 | J3.2 17.78,4.95
  Top 0.254: U4.44 34.53,16.12 | 34.53,16.12 34.54,16.13 35.64,16.13 35.92,15.85 35.92,14.63 | J2.2 39.49,14.61 v36.7,14.61 35.94,14.61 35.92,14.63 | 34.53,16.12 34.53,16.92 C4.2 | C10.2 33.72,11.71 33.97,11.96 35.33,11.96 35.92,12.55 35.92,14.63 | U6.5 13.24,19.08 13.46,19.3 | 13.24,17.94 13.24,17.39 12.15,16.31 12.15,15.02 v12.19,14.99
  Top 0.279: R6.2 9.11,23.58 9.65,24.13 12.06,24.13 12.53,23.66 C12.1 C14.2 12.53,19.68 | 13.24,17.94 U6.5 | v15.24,18.92 13.84,18.92 13.46,19.3 13.08,19.68 12.53,19.68 | C13.+ 12.53,19.68
  Bottom 0.152: v21.72,14.99 22.1,15.37 25.53,15.37 26.29,16.13 27.18,16.13 v27.3,16 27.94,15.37 v28.83,15.37 | v28.83,13.34 28.83,11.3 29.84,10.29 v30.73,10.29 | v12.19,14.99 12.93,14.25 12.93,13.72 14.48,12.17 14.48,7.39 | v21.46,24.26 16.64,24.26 15.24,22.86 v15.24,18.92 v18.54,18.92 | v14.73,6.6 14.48,6.86 14.48,7.39 | LED.1 14.48,7.39
  Bottom 0.279: U3.3.3V 36.94,14.37 v36.7,14.61
!RFM_CS  (via drill 0.3)
  Top 0.152: v28.19,16 28.21,15.98 U4.28 | v21.72,16.89 21.72,16.26 21.46,16 R4.1
  Bottom 0.152: v28.19,16 27.56,16.64 26.29,16.64 26.02,16.37 U3.NSS 22.24,16.37 v21.72,16.89
!RFM_RST  (via drill 0.3)
  Top 0.152: v29.46,16 29.46,15.24 29.21,14.99 v29.21,14.1 | U4.30 29.21,9.91 29.08,9.78 v28.45,9.78
  Bottom 0.152: v29.46,16 28.32,17.14 27.43,17.14 26.21,18.37 U3.!RESET | v29.21,14.1 28.83,14.1 27.81,13.08 27.81,10.41 v28.45,9.78
!RST  (via drill 0.3)
  Top 0.152: v32,14.35 32,14.22 32.11,14.12 U4.40 v33.62,14.12 v33.63,14.12 | v22.1,25.02 15.11,25.02 13.97,26.16 13.97,27.56 13.59,27.94 10.79,27.94 10.29,27.43 10.29,26.67 10.03,26.42 v9.53,26.42 S3.1 | R6.1 7.41,23.91 v7.75,24.26 | v33.27,8 32.77,7.49 32.77,4.06 J3.8
  Bottom 0.152: v32,14.35 32.89,13.46 32.89,10.79 32.64,10.54 32.64,9.14 33.27,8.51 v33.27,8 | v22.1,25.02 32.77,25.02 33.66,24.13 33.66,21.46 34.92,20.19 36.32,20.19 36.7,19.81 36.7,17.88 37.21,17.37 40.36,17.37 40.66,17.07 40.66,13.82 40.28,13.44 37.36,13.44 36.65,12.72 35.03,12.72 v33.63,14.12 | v9.53,26.42 9.53,25.15 8.64,24.26 v7.75,24.26
A0  (via drill 0.3)
  Top 0.152: U4.3 31.21,19.59 v31.11,19.68 | v32.77,19.68 34.92,19.68 35.56,20.32 J11.9
  Bottom 0.152: v31.11,19.68 v32.77,19.68
A1  (via drill 0.3)
  Top 0.152: U4.7 29.21,19.31 v29.59,19.68 | v33.02,23.37 J11.8
  Bottom 0.152: v29.59,19.68 30.23,20.32 32.51,20.32 32.77,20.57 33.02,20.83 v33.02,23.37
A2  (via drill 0.3)
  Top 0.152: U4.8 28.71,19.57 v28.83,19.68 | v30.48,23.37 J11.7
  Bottom 0.152: v28.83,19.68 30.48,21.34 v30.48,23.37
A3
  Top 0.152: J11.6 28.19,26.42 28.19,21.34 28.45,21.08 28.45,20.32 28.21,20.09 U4.9
A4
  Top 0.152: J11.5 26.04,26.67 27.56,25.15 27.56,22.86 27.56,22.1 27.56,21.46 28.07,20.95 28.07,20.45 27.71,20.09 U4.10
ANT
  Top 1.473: J13.FEED J4.1
  Bottom 1.016: U3.ANT 38.12,22.99
  Bottom 1.473: 38.12,22.99 38.1,23.01 J4.1
CHARGE_STAT
  Top 0.152: U1.1 18.7,16.16 15.62,13.08 15.62,12.79 R9.1
D2
  Top 0.152: J3.6 27.94,5.71 25.15,8.51 25.15,12.57 25.69,13.12 U4.23
D3
  Top 0.152: U4.14 25.49,17.62 24.38,16.51 24.38,4.83 J3.5
D4
  Top 0.152: J3.4 24,4.95 24,16.76 25.36,18.12 U4.13
D5
  Top 0.152: U4.24 25.7,12.62 25.53,12.45 25.53,8.64 27.43,6.73 30.35,3.81 J3.7
D9
  Top 0.152: U4.12 24.86,18.77 23.62,17.53 23.62,14.73 23.62,12.7 23.62,6.48 20.95,3.81 J3.3
D10_LORA-WAN  (via drill 0.3)
  Top 0.152: v26.92,8.51 27.71,9.3 U4.27
  Bottom 0.152: v26.92,8.51 26.04,8.51 25.15,9.4 19.43,9.4 19.15,9.12 JP3.2
D11_LORA-WAN  (via drill 0.3)
  Top 0.152: v26.54,10.67 26.71,10.84 U4.25
  Bottom 0.152: v26.54,10.67 26.42,10.67 25.78,11.3 18.16,11.3 17.78,10.92 17.78,8.64 17.53,8.38 JP4.2
D+  (via drill 0.3)
  Top 0.152: J1.D+ 5.71,20.32 v6.73,19.3 | U4.34 31.21,11.15 30.99,10.92 30.48,10.92 29.97,10.41 29.97,8.38 v28.96,7.37
  Bottom 0.152: v6.73,19.3 6.86,19.43 11.94,19.43 13.23,18.14 13.23,13.87 14.8,12.31 14.8,7.3 15.75,6.35 27.94,6.35 v28.96,7.37
D-  (via drill 0.3)
  Top 0.152: J1.D- 5.83,20.97 v6.73,20.07 | U4.33 30.71,11.41 30.61,11.3 30.23,11.3 29.59,10.67 29.59,8.89 v28.13,7.43
  Bottom 0.152: v6.73,20.07 12.06,20.07 13.59,18.54 13.59,13.92 15.07,12.43 15.07,7.53 15.88,6.73 27.43,6.73 v28.13,7.43
GND  (via drill 0.3)
  Top 0.152: J1.GND 5.87,19.02 v6.22,18.67 | v33.66,15.11 v33.65,15.12 U4.42 v32.01,15.12 v32,15.11 | U4.35 31.71,12.79 v31.75,12.83 | U4.18 25.14,15.62 24.77,15.24 24.77,6.48 v26.54,4.7 | U4.5 30.21,19.55 v30.35,19.68 | J2.1 36.83,13.61
  Bottom 0.152: v31.75,12.83 31.37,13.21 31.37,14.73 31.75,15.11 v32,15.11 | v36.73,13.72 35.33,15.11 v33.66,15.11
  other vias: 2.92,27.05 35.69,19.3 35.69,18.41 36.58,25.53 34.42,24.13 23.24,23.62 14.99,14.22 16,20.95 26.54,24.13 29.21,24.13 31.75,24.13 21.46,8.51 2.54,11.43 6.35,13.97 6.35,8.89 19.81,16.89 10.16,13.97
  pour Bottom (isolate 0.152): 0,30.48 44.45,30.48 44.45,0 0,0 0,15.24 5.08,15.24 5.08,25.4 0,25.4
  pour Top (isolate 0.152): 44.45,30.48 0,30.48 0,25.4 5.08,25.4 5.08,15.24 0,15.24 0,0 44.45,0
MISO  (via drill 0.3)
  Top 0.152: U4.21 26.65,14.12 26.8,13.97 26.8,13.21 v27.18,12.83 | v21.34,10.67 v21.34,11.94
  Bottom 0.152: J11.2 17.78,26.16 17.02,25.4 15.75,25.4 13.84,23.5 13.84,14.1 16,11.94 v21.34,11.94 | v21.34,10.67 21.64,10.37 U3.MISO 25.7,10.37 26.04,10.03 26.92,10.03 27.18,10.29 v27.18,12.83
MOSI  (via drill 0.3)
  Top 0.152: U4.19 26.67,15.12 26.8,15.24 27.18,15.24 27.56,14.86 v27.56,13.72
  Bottom 0.152: v27.56,13.72 27.3,13.72 25.96,12.37 U3.MOSI 21.92,12.37 21.72,12.57 20.57,12.57 20.45,12.45 15.98,12.45 14.22,14.2 14.22,23.24 16,25.02 18.67,25.02 J11.3
N$1
  Top 0.152: R10.2 D6.C
N$2
  Top 0.152: R7.2 D1.C
N$3  (via drill 0.3)
  Top 0.152: D2.C 17.65,14.1 v17.53,14.22
  Bottom 0.152: R3.2 18.92,13.25 18.92,14.1 18.8,14.22 v17.53,14.22
N$4
  Top 0.152: U4.43 33.96,15.62 34.4,15.18 C7.2
N$5  (via drill 0.35)
  Top 0.152: R13.2 13.92,10.79 v13.89,10.77
  Bottom 0.152: LED.2 11.63,8.18 11.81,8.36 13.69,8.36 13.89,8.56 v13.89,10.77
N$6
  Top 0.152: U4.1 32.21,21.16 32.38,21.34 Y1.P$2 34.08,21.34 C2.2
N$7
  Top 0.152: U4.2 31.71,21.12 31.5,21.34 30.73,21.34 Y1.P$1 29.68,21.34 C3.2
N$8
  Top 0.152: D4.C R9.2
N$9
  Top 0.152: S1.1 8.76,5.97 | F1.2
  Top 0.279: J9.2 10.54,5.97 10.03,5.97 | 8.76,5.97 10.03,5.97 | F1.2 10.03,5.97
N$11
  Top 0.152: U1.5 16.1,16.67 15.75,17.02 14.99,17.02 14.73,17.27 R5.1
N$17
  Bottom 0.152: U3.DIO1 37.04,10.37 36.96,10.29 36.96,7.87 36.6,7.52 30.2,7.52 29.08,8.64 27.81,8.64 26.67,7.49 20.19,7.49 19.96,7.72 JP3.1
N$18
  Bottom 0.152: U3.DIO2 38.74,7.63 38.33,7.21 30,7.21 28.96,8.26 27.94,8.26 26.8,7.11 16,7.11 15.72,7.39 JP4.1
N$38
  Top 0.152: R13.1 LED1.A
RAW  (via drill 0.3)
  Top 0.254: J3.1 12.83,6.22 F1.1 12.7,7.75
  Top 0.279: 12.7,7.75 12.19,7.75 10.92,9.02 9.14,9.02 v8.76,9.4
  Bottom 0.279: v8.76,9.4 8.26,9.91 D3.C 6.28,10.53 Q1.2
RFM_INT  (via drill 0.3)
  Top 0.152: v33.78,9.65 30.99,9.65 30.86,9.53 v30.61,9.53 | U4.29 28.71,10.68 v28.57,10.54
  Bottom 0.152: v28.57,10.54 29.59,9.53 v30.61,9.53 | v33.78,9.65 35.18,8.26 36.07,8.26 36.58,8.76 36.58,11.94 37.01,12.37 U3.DIO0
RX_LED  (via drill 0.3)
  Top 0.152: v31.24,17.91 31.45,18.12 U4.48 | R10.1 15.28,9.69 15.62,10.03 21.84,10.03 21.97,10.16 v21.97,13.34
  Bottom 0.152: v21.97,13.34 26.42,13.34 27.56,14.48 27.94,14.48 28.32,14.48 28.83,14.48 30.1,15.75 30.1,16.76 v31.24,17.91
RXI  (via drill 0.3)
  Top 0.152: U4.16 30.12,16.62 30.48,16.26 v30.48,13.59 | v31.24,9.02 34.42,9.02 35.31,8.13 35.31,6.99 38.1,4.19 J3.10
  Bottom 0.152: v30.48,13.59 30.35,13.46 30.35,12.7 31.37,11.68 31.37,9.14 v31.24,9.02
SCK  (via drill 0.3)
  Top 0.152: v26.92,14.61 26.08,14.61 U4.20
  Bottom 0.152: v26.92,14.61 25.78,14.61 25.54,14.37 U3.SCK 20.68,14.37 19.49,15.56 15.05,15.56 14.61,16 14.61,22.99 16.26,24.64 20.83,24.64 J11.4
SCL  (via drill 0.3)
  Top 0.152: J2.4 36.85,16.61 v36.7,16.76 | U4.32 30.21,12.84 29.84,13.21 v29.84,14.73
  Bottom 0.152: v36.7,16.76 35.69,17.78 31.88,17.78 31.37,17.27 31.11,17.27 30.42,16.57 30.42,15.3 v29.84,14.73
SDA  (via drill 0.3)
  Top 0.152: J2.3 37.02,15.61 v36.91,15.49 | U4.31 29.71,12.58 v29.46,12.83
  Bottom 0.152: v36.91,15.49 35,17.4 32,17.4 31.5,16.89 31.37,16.89 30.73,16.26 30.73,14.86 29.46,13.59 v29.46,12.83
SHLD  (via drill 0.3, 0.35)
  Top 0.152: J1.SHIELD8 1.27,23.11 v1.27,24.26 | J1.SHIELD6 1.27,17.53 v1.27,16.37
  pour Top (isolate 0.203): 0,24.89 4.57,24.89 4.57,16 0,16
  pour Bottom (isolate 0.203): 4.57,24.89 0,24.89 0,16 4.57,16
STAT_LED  (via drill 0.3)
  Top 0.152: U4.26 27.21,10.32 26.29,9.4 26.29,8.38 29.34,5.33 v29.59,5.33 | v21.21,5.33 23.24,7.37 23.24,13.59 22.73,14.1 D2.A
  Bottom 0.152: v21.21,5.33 v29.59,5.33
SWDCLK  (via drill 0.3)
  Top 0.152: v32,13.59 31.37,14.22 31.37,15.37 32.13,16.13 32.13,16.26 32.49,16.62 U4.45 | v32.51,8 v30.86,6.35
  Bottom 0.152: v32,13.59 32.59,13.01 32.59,10.92 32.26,10.59 32.26,9.02 32.51,8.76 v32.51,8 | v30.86,6.35 TP2.P$1 32.33,6.93 41.22,6.93 J14.1
SWDIO  (via drill 0.3)
  Top 0.152: v31.5,16.26 32.36,17.12 U4.46 | v34.04,8 34.04,7.49 33.4,6.86 v33.4,6.35
  Bottom 0.152: v31.5,16.26 32.77,16.26 33.15,15.88 33.15,13.64 33.2,13.59 33.2,10.67 33.15,10.62 33.15,9.14 34.04,8.26 v34.04,8 | v33.4,6.35 TP1.P$1 J10.1
TX_LED  (via drill 0.3)
  Top 0.152: U4.39 33.42,13.62 v33.66,13.39 | R7.1 15.28,6.31 15.88,5.71 v16.64,5.71 | v37.21,5.84 35.69,7.37 35.69,8.89 v35.05,9.53
  Bottom 0.152: v35.05,9.53 33.66,10.92 v33.66,13.39 | v16.64,5.71 17.78,5.71 18.03,5.97 28.19,5.97 28.45,6.22 29.59,6.22 30.23,5.59 36.96,5.59 v37.21,5.84
TXO  (via drill 0.3)
  Top 0.152: U4.15 30.13,17.12 30.86,16.38 30.86,16.13 30.86,14.22 31.11,13.97 31.11,12.95 v30.99,12.83 | J3.9 35.56,6.22 34.92,6.86 34.92,8 34.29,8.64 32,8.64 v31.75,8.38
  Bottom 0.152: v30.99,12.83 30.99,12.7 31.88,11.81 31.88,10.16 31.88,8.51 v31.75,8.38
V_BATT
  Top 0.152: C1.+
  Top 0.254: J7.2 12.95,12.7 13.59,13.34 15.37,13.34 17.78,15.75 17.78,18.16 | 17.78,18.16 17.78,19.05 | U1.3 17.85,18.09 17.78,18.16
  Top 0.279: 17.78,19.05 C1.+ | C1.+ 18.8,22.1 19.3,21.59 19.3,20.45 19.81,19.94 R1.2 | J12.2 11.16,12.43 J7.2
  Bottom 0.279: J7.2 10.29,11.56 Q1.3
V_USB  (via drill 0.3)
  Top 0.152: D4.A 20.83,12.45 21.21,12.83 v21.21,13.21
  Top 0.254: J1.VBUS v5.59,21.62 | J8.2 12.7,24.89 | C9.1 16.73,19.39 16.1,18.77 U1.4 16.16,18.03 17.02,18.03 17.27,17.78 17.27,16 16.26,14.99 v15.75,14.99
  Top 0.279: C11.2 7.25,21.62 v5.59,21.62 5.59,23.75 6.73,24.89 12.7,24.89 14.61,24.89 16.73,22.77 C9.1
  Bottom 0.152: v21.21,13.21 21.21,13.34 19.56,14.99 v15.75,14.99
  Bottom 0.279: v5.59,21.62 5.59,16.51 6.18,15.91 R8.2 7.37,12.83 | Q1.1 6.92,12.51 7.24,12.83 7.37,12.83 | 7.37,12.83 8.25,12.83 D3.A
VBATT_LVL  (via drill 0.3)
  Top 0.152: R2.2 R1.1 25.4,19.94 v26.04,19.3 | v30.48,17.91 31.11,17.27 31.62,17.27 31.97,17.62 U4.47
  Bottom 0.152: v30.48,17.91 30.48,17.65 30.1,17.27 29.46,17.27 29.21,17.53 27.56,17.53 26.04,19.05 v26.04,19.3
VDDANA  (via drill 0.3)
  Top 0.152: U4.6 v29.71,17.91 v29.72,17.91 | v27.43,20.7 26.45,20.7 C15.2 L1.2
  Bottom 0.152: v29.72,17.91 27.69,17.91 27.43,18.16 v27.43,20.7
VIN
  Top 0.152: 7.11,5.83 S1.2
  Top 0.254: S1.2 7.1,3.57 7.62,3.05 8.64,3.05 10.41,1.27 J9.1 | 7.11,5.83 7.11,7.24 6.73,7.62 5.21,7.62 4.57,8.26 4.57,14.61 6.26,16.3 C5.1 9.36,16.3 9.59,16.07 U6.3 11.5,16.07 11.68,16.26 11.68,17.78 11.5,17.97 U6.1

### Text on the board
Bottom: v11
tPlace: + | -
bPlace: + | -
bValues: RFM69 / or / RFM95W
Measures: Units in Inches
tDocu: Two Layer / 0.8mm Thickness / 1 oz. Copper / Red Soldermask / White Silkscreen / HASL Lead Free / Material: TG135-140 | Elias Santistevan | Revised by: | Pete Lewis